# Altium schematic sheet STM32.SchDoc
size A4; SheetNumber: 2; SheetTotal: 2
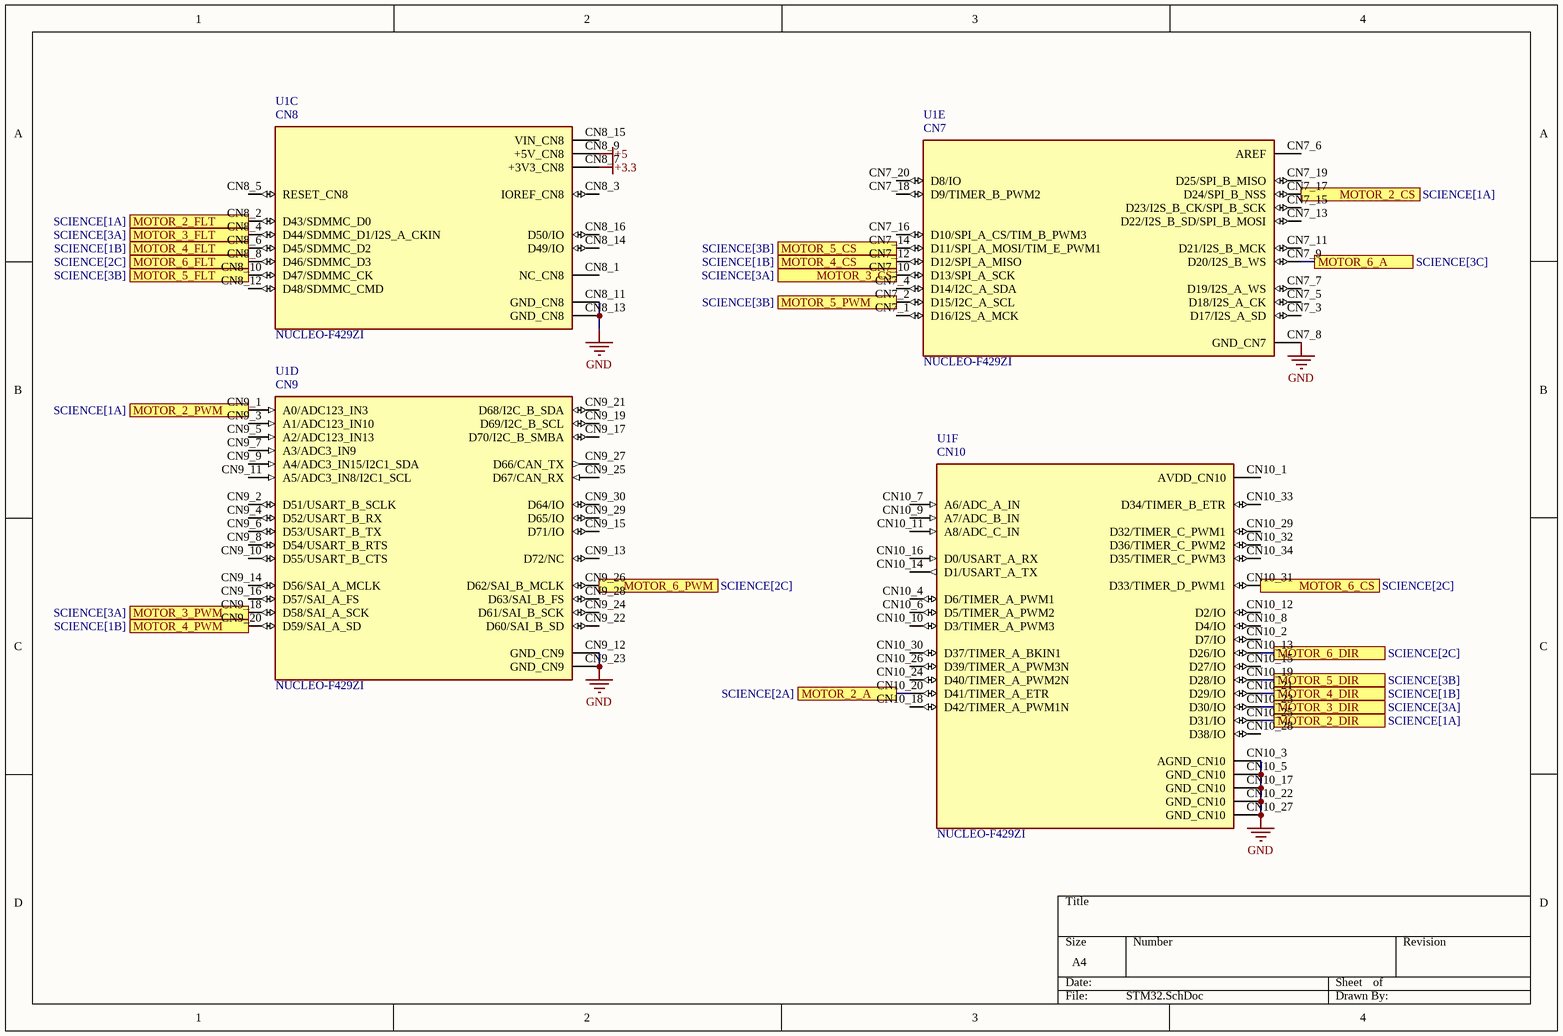
[diagram p0: STM32.SchDoc]

## Parts
U1  NUCLEO-F429ZI  [MODULE_NUCLEO-F429ZI]  (parts C,D,E,F of 6)

## Ports
MOTOR_2_A (see SCIENCE[2A]), MOTOR_2_CS (see SCIENCE[1A]), MOTOR_2_DIR (see SCIENCE[1A]), MOTOR_2_FLT (see SCIENCE[1A]), MOTOR_2_PWM (see SCIENCE[1A]), MOTOR_3_CS (see SCIENCE[3A]), MOTOR_3_DIR (see SCIENCE[3A]), MOTOR_3_FLT (see SCIENCE[3A]), MOTOR_3_PWM (see SCIENCE[3A]), MOTOR_4_CS (see SCIENCE[1B]), MOTOR_4_DIR (see SCIENCE[1B]), MOTOR_4_FLT (see SCIENCE[1B]), MOTOR_4_PWM (see SCIENCE[1B]), MOTOR_5_CS (see SCIENCE[3B]), MOTOR_5_DIR (see SCIENCE[3B]), MOTOR_5_FLT (see SCIENCE[3B]), MOTOR_5_PWM (see SCIENCE[3B]), MOTOR_6_A (see SCIENCE[3C]), MOTOR_6_CS (see SCIENCE[2C]), MOTOR_6_DIR (see SCIENCE[2C]), MOTOR_6_FLT (see SCIENCE[2C]), MOTOR_6_PWM (see SCIENCE[2C])

## Nets
+3.3: U1.CN8_7(+3V3_CN8)
+5: U1.CN8_9(+5V_CN8)
GND: U1.CN7_8(GND_CN7) U1.CN8_11(GND_CN8) U1.CN8_13(GND_CN8) U1.CN9_12(GND_CN9) U1.CN9_23(GND_CN9) U1.CN10_3(AGND_CN10) U1.CN10_5(GND_CN10) U1.CN10_17(GND_CN10) U1.CN10_22(GND_CN10) U1.CN10_27(GND_CN10)
MOTOR_2_A: U1.CN10_20(D41/TIMER_A_ETR) ; port MOTOR_2_A
MOTOR_2_CS: U1.CN7_17(D24/SPI_B_NSS) ; port MOTOR_2_CS
MOTOR_2_DIR: U1.CN10_25(D31/IO) ; port MOTOR_2_DIR
MOTOR_2_FLT: U1.CN8_2(D43/SDMMC_D0) ; port MOTOR_2_FLT
MOTOR_2_PWM: U1.CN9_1(A0/ADC123_IN3) ; port MOTOR_2_PWM
MOTOR_3_CS: U1.CN7_10(D13/SPI_A_SCK) ; port MOTOR_3_CS
MOTOR_3_DIR: U1.CN10_23(D30/IO) ; port MOTOR_3_DIR
MOTOR_3_FLT: U1.CN8_4(D44/SDMMC_D1/I2S_A_CKIN) ; port MOTOR_3_FLT
MOTOR_3_PWM: U1.CN9_18(D58/SAI_A_SCK) ; port MOTOR_3_PWM
MOTOR_4_CS: U1.CN7_12(D12/SPI_A_MISO) ; port MOTOR_4_CS
MOTOR_4_DIR: U1.CN10_21(D29/IO) ; port MOTOR_4_DIR
MOTOR_4_FLT: U1.CN8_6(D45/SDMMC_D2) ; port MOTOR_4_FLT
MOTOR_4_PWM: U1.CN9_20(D59/SAI_A_SD) ; port MOTOR_4_PWM
MOTOR_5_CS: U1.CN7_14(D11/SPI_A_MOSI/TIM_E_PWM1) ; port MOTOR_5_CS
MOTOR_5_DIR: U1.CN10_19(D28/IO) ; port MOTOR_5_DIR
MOTOR_5_FLT: U1.CN8_10(D47/SDMMC_CK) ; port MOTOR_5_FLT
MOTOR_5_PWM: U1.CN7_2(D15/I2C_A_SCL) ; port MOTOR_5_PWM
MOTOR_6_A: U1.CN7_9(D20/I2S_B_WS) ; port MOTOR_6_A
MOTOR_6_CS: U1.CN10_31(D33/TIMER_D_PWM1) ; port MOTOR_6_CS
MOTOR_6_DIR: U1.CN10_13(D26/IO) ; port MOTOR_6_DIR
MOTOR_6_FLT: U1.CN8_8(D46/SDMMC_D3) ; port MOTOR_6_FLT
MOTOR_6_PWM: U1.CN9_26(D62/SAI_B_MCLK) ; port MOTOR_6_PWM

Not connected (* = marked no-connect by the designer): U1 CN7_1(D16/I2S_A_MCK) CN7_3(D17/I2S_A_SD) CN7_4(D14/I2C_A_SDA) CN7_5(D18/I2S_A_CK) CN7_6(AREF) CN7_7(D19/I2S_A_WS) CN7_11(D21/I2S_B_MCK) CN7_13(D22/I2S_B_SD/SPI_B_MOSI) CN7_15(D23/I2S_B_CK/SPI_B_SCK) CN7_16(D10/SPI_A_CS/TIM_B_PWM3) CN7_18(D9/TIMER_B_PWM2) CN7_19(D25/SPI_B_MISO) CN7_20(D8/IO) CN8_1(NC_CN8) CN8_3(IOREF_CN8) CN8_5(RESET_CN8) CN8_12(D48/SDMMC_CMD) CN8_14(D49/IO) CN8_15(VIN_CN8) CN8_16(D50/IO) CN9_2(D51/USART_B_SCLK) CN9_3(A1/ADC123_IN10) CN9_4(D52/USART_B_RX) CN9_5(A2/ADC123_IN13) CN9_6(D53/USART_B_TX) CN9_7(A3/ADC3_IN9) CN9_8(D54/USART_B_RTS) CN9_9(A4/ADC3_IN15/I2C1_SDA) CN9_10(D55/USART_B_CTS) CN9_11(A5/ADC3_IN8/I2C1_SCL) CN9_13(D72/NC) CN9_14(D56/SAI_A_MCLK) CN9_15(D71/IO) CN9_16(D57/SAI_A_FS) CN9_17(D70/I2C_B_SMBA) CN9_19(D69/I2C_B_SCL) CN9_21(D68/I2C_B_SDA) CN9_22(D60/SAI_B_SD) CN9_24(D61/SAI_B_SCK) CN9_25(D67/CAN_RX) CN9_27(D66/CAN_TX) CN9_28(D63/SAI_B_FS) CN9_29(D65/IO) CN9_30(D64/IO) CN10_1(AVDD_CN10) CN10_2(D7/IO) CN10_4(D6/TIMER_A_PWM1) CN10_6(D5/TIMER_A_PWM2) CN10_7(A6/ADC_A_IN) CN10_8(D4/IO) CN10_9(A7/ADC_B_IN) CN10_10(D3/TIMER_A_PWM3) CN10_11(A8/ADC_C_IN) CN10_12(D2/IO) CN10_14(D1/USART_A_TX) CN10_15(D27/IO) CN10_16(D0/USART_A_RX) CN10_18(D42/TIMER_A_PWM1N) CN10_24(D40/TIMER_A_PWM2N) CN10_26(D39/TIMER_A_PWM3N) CN10_28(D38/IO) CN10_29(D32/TIMER_C_PWM1) CN10_30(D37/TIMER_A_BKIN1) CN10_32(D36/TIMER_C_PWM2) CN10_33(D34/TIMER_B_ETR) CN10_34(D35/TIMER_C_PWM3)

## Notes on the sheet
- (in symbol NUCLEO-F429ZI, part C) CN8
- (in symbol NUCLEO-F429ZI, part D) CN9
- (in symbol NUCLEO-F429ZI, part E) CN7
- (in symbol NUCLEO-F429ZI, part F) CN10

## Library data of the parts
U1 = NUCLEO-F429ZI: STM32F429ZI, mbed-Enabled Development Nucleo-144 STM32F4 ARMÂ® CortexÂ®-M4 MCU 32-Bit Embedded Evaluation Board; MF: STMicroelectronics; Value: *; SnapEDA_Link: https://www.snapeda.com/parts/NUCLEO-F429ZI/STMicroelectronics/view-part/?ref=snap; MP: NUCLEO-F429ZI; Purchase-URL: https://pricing.snapeda.com/search/part/NUCLEO-F429ZI/?ref=eda; Check_prices: https://www.snapeda.com/parts/NUCLEO-F429ZI/STMicroelectronics/view-part/?ref=eda; Availability: In Stock; Price: None; Package: None